# Altium schematic sheet Power.SchDoc
size A
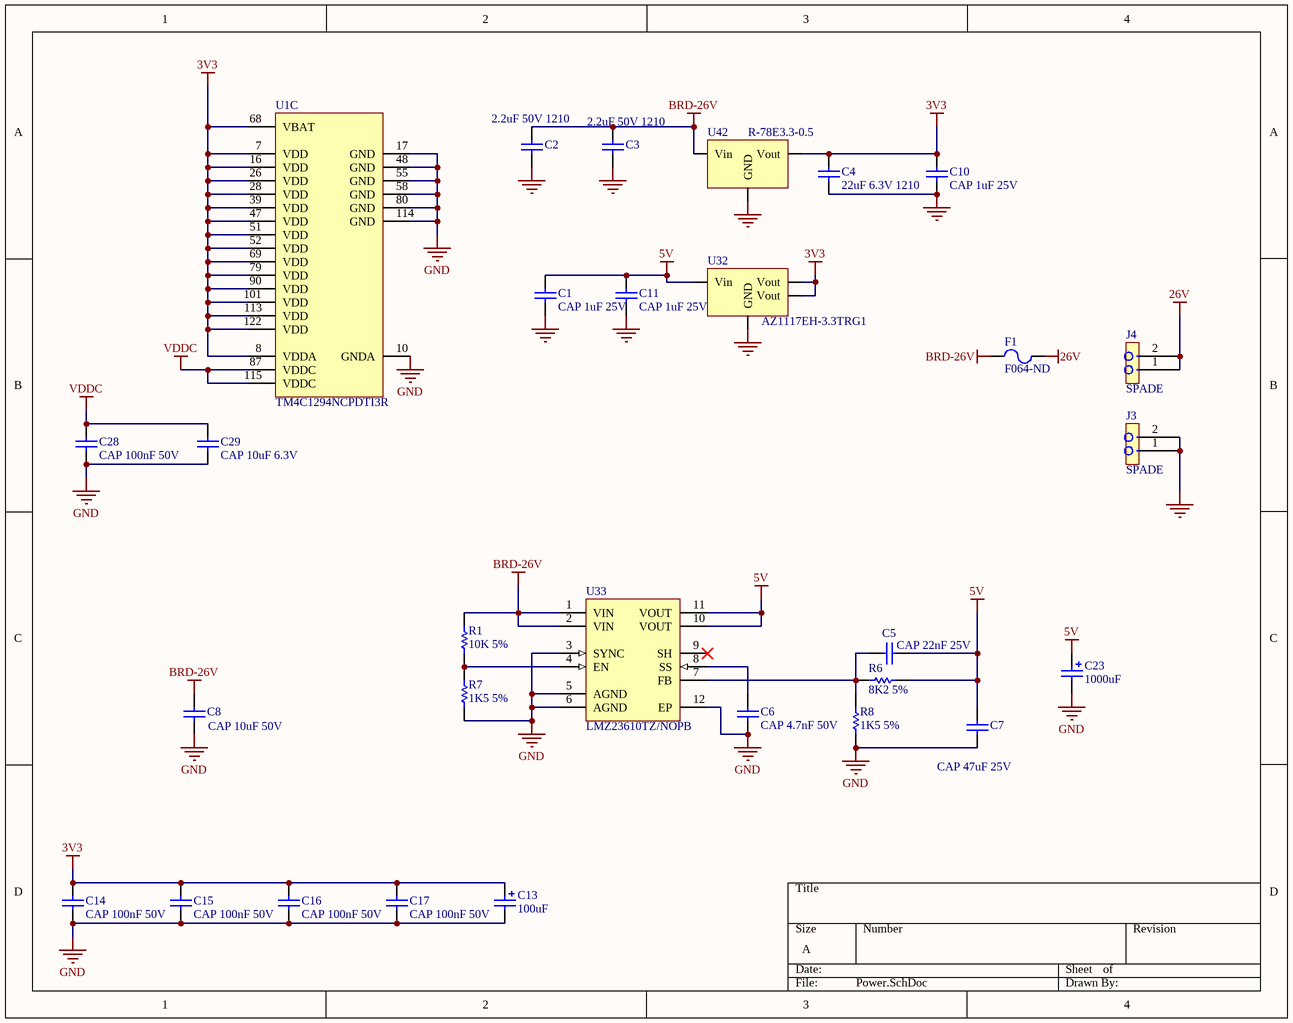
[diagram p0: Power.SchDoc]

## Parts
C1  CAP 1uF 25V  [CAPC0603(1608)100_M]
C2  2.2uF 50V 1210  [CAPC1210(3225)280_M]
C3  2.2uF 50V 1210  [CAPC1210(3225)280_M]
C4  22uF 6.3V 1210  [CAPC1210(3225)220_N]
C5  CAP 22nF 25V  [CAPC0805(2012)100_M]
C6  CAP 4.7nF 50V  [CAPC0603(1608)100_M]
C7  CAP 47uF 25V  [CAPC1206(3216)100_L]
C8  CAP 10uF 50V  [CAPC1206(3216)190_M]
C10  CAP 1uF 25V  [CAPC0603(1608)100_M]
C11  CAP 1uF 25V  [CAPC0603(1608)100_M]
C13  100uF  [PANASONIC_C]
C14  CAP 100nF 50V  [CAPC0603(1608)100_M]
C15  CAP 100nF 50V  [CAPC0603(1608)100_M]
C16  CAP 100nF 50V  [CAPC0603(1608)100_M]
C17  CAP 100nF 50V  [CAPC0603(1608)100_M]
C23  1000uF  [PANASONIC_H13]
C28  CAP 100nF 50V  [CAPC0603(1608)100_M]
C29  CAP 10uF 6.3V  [CAPC0603(1608)100_M]
F1  Supplier Part Number 1: F064-ND  [FUSE_HOLDER]  (hidden comment: FUSE-2)
J3  SPADE  [SPADE-6.35-RA]
J4  SPADE  [SPADE-6.35-RA]
R1  10K 5%  [RESC0603(1608)_M]
R6  8K2 5%  [RESC0603(1608)_L]
R7  1K5 5%  [RESC0603(1608)_M]
R8  1K5 5%  [RESC0603(1608)_M]
U1  TM4C1294NCPDTI3R  [TI-PDT128_M]  (part C of 3)
U32  AZ1117EH-3.3TRG1  [SOT-223]
U33  LMZ23610TZ/NOPB  [NDY0011A_M]
U42  R-78E3.3-0.5  [Buck_mod]

## Nets
3V3: C4.2 C10.2 C13.+ C14.2 C15.2 C16.2 C17.2 U1.7(VDD) U1.8(VDDA) U1.16(VDD) U1.26(VDD) U1.28(VDD) U1.39(VDD) U1.47(VDD) U1.51(VDD) U1.52(VDD) U1.68(VBAT) U1.69(VDD) U1.79(VDD) U1.90(VDD) U1.101(VDD) U1.113(VDD) U1.122(VDD) U32.2(Vout) U32.4(Vout) U42.3(Vout)
5V: C1.2 C5.2 C7.1 C11.2 C23.+ R6.1 U32.3(Vin) U33.10(VOUT) U33.11(VOUT)
26V: F1.1 J4.1 J4.2
BRD-26V: C2.2 C3.2 C8.1 F1.2 R1.2 U33.1(VIN) U33.2(VIN) U42.1(Vin)
GND: C1.1 C2.1 C3.1 C4.1 C6.1 C7.2 C8.2 C10.1 C11.1 C13.- C14.1 C15.1 C16.1 C17.1 C23.- C28.1 C29.1 J3.1 J3.2 R7.1 R8.1 U1.10(GNDA) U1.17(GND) U1.48(GND) U1.55(GND) U1.58(GND) U1.80(GND) U1.114(GND) U32.1(GND) U33.3(SYNC) U33.5(AGND) U33.6(AGND) U33.12(EP) U42.2(GND)
VDDC: C28.2 C29.2 U1.87(VDDC) U1.115(VDDC)
NetC5_1: C5.1 R6.2 R8.2 U33.7(FB)
NetC6_2: C6.2 U33.8(SS)
NetR1_1: R1.1 R7.2 U33.4(EN)

Not connected (* = marked no-connect by the designer): U33 9(SH)*

## Library data of the parts
C1 C10 C11 = CMP-1035-00037-1: CAP 1uF 25V Â±0.25pF 0603 (1608 Metric) Thickness 1mm SMD; Case-Metric: 1608; Case-EIA: 0603; Tolerance: Â±0.25pF; Max Thickness: 1 mm; Value: 1uF; Technology: SMT; Rated Voltage: 25 V
C2 C3 = CMP-1038-02102-1: CAP 2.2uF 50V ±20% 1210 (3225 Metric) Thickness 2.8mm SMD; Case-Metric: 3225; Case-EIA: 1210; Tolerance: Â±20%; Rated Voltage: 50 V; Technology: SMT; Value: 2.2uF; Max Thickness: 2.8 mm
C4 = CMP-1038-02259-1: CAP 22uF 6.3V ±10% 1210 (3225 Metric) Thickness 2.2mm SMD; Case-Metric: 3225; Case-EIA: 1210; Tolerance: Â±10%; Max Thickness: 2.2 mm; Rated Voltage: 6.3 V; Technology: SMT; Value: 22uF
C5 = CMP-1036-04051-1: CAP 22nF 25V Â±5% 0805 (2012 Metric) Thickness 1mm SMD; Case-Metric: 2012; Case-EIA: 0805; Technology: SMT; Max Thickness: 1 mm; Value: 22nF; Rated Voltage: 25 V; Tolerance: Â±5%
C6 = CMP-1035-00333-1: CAP 4.7nF 50V Â±20% 0603 (1608 Metric) Thickness 1mm SMD; Case-EIA: 0603; Case-Metric: 1608; Max Thickness: 1 mm; Rated Voltage: 50 V; Technology: SMT; Tolerance: Â±20%; Value: 4.7nF
C7 = CMP-1037-00376-1: CAP 47uF 25V Â±0.25pF 1206 (3216 Metric) Thickness 1mm SMD; Case-EIA: 1206; Case-Metric: 3216; Technology: SMT; Max Thickness: 1 mm; Value: 47uF; Tolerance: Â±0.25pF; Rated Voltage: 25 V
C8 = CMP-1037-04982-1: CAP 10uF 50V Â±10% 1206 (3216 Metric) Thickness 1.9mm SMD; Case-EIA: 1206; Case-Metric: 3216; Technology: SMT; Tolerance: Â±10%; Max Thickness: 1.9 mm; Value: 10uF; Rated Voltage: 50 V
C13 = Cap_Polarized_100uF: Polarized Capacitor (Surface Mount); Published: 8-Jun-2000; LatestRevisionDate: 29-May-2009; LatestRevisionNote: IPC-7351 Footprint Added.; PackageReference: C0805; Publisher: Altium Limited; PackageDescription: Chip Capacitor; Value: 100uF; Supplier 1: Digi-Key; Supplier 2: Mouser; Supplier Part Number 1: PCE4718CT-ND; Supplier Part Number 2: 667-EEE-HAJ101WAR
C14-C17 C28 = CMP-1035-00010-1: CAP 100nF 50V Â±0.1pF 0603 (1608 Metric) Thickness 1mm SMD; Case-Metric: 1608; Case-EIA: 0603; Tolerance: Â±0.1pF; Technology: SMT; Value: 100nF; Max Thickness: 1 mm; Rated Voltage: 50 V
C23 = Cap_Polarized_1000uF: Polarized Capacitor (Surface Mount); Published: 8-Jun-2000; LatestRevisionDate: 29-May-2009; LatestRevisionNote: IPC-7351 Footprint Added.; PackageReference: C0805; Publisher: Altium Limited; PackageDescription: Chip Capacitor; Value: 1000uF; Supplier 1: Digi-Key; Supplier 2: Mouser; Supplier Part Number 1: PCE3462CT-ND; Supplier Part Number 2: 140-VE102M1ETR1313
C29 = CMP-1035-02796-1: CAP 10uF 6.3V ±10% 0603 (1608 Metric) Thickness 1mm SMD; Case-EIA: 0603; Tolerance: Â±10%; Case-Metric: 1608; Value: 10uF; Technology: SMT; Rated Voltage: 6.3 V; Max Thickness: 1 mm
J3 J4 = CON2: 6.35mm right-angle 90° male spade terminal PCB mount; CID: 643; CID2: 643; CID3: 643
R1 = CMP-1012-00098-1: 10K 0.1W 5% 0603 (1608 Metric)  SMD; Case-EIA: 0603; Value: 10000.00 Ohm; Case-Metric: 1608; Technology: SMT; Tolerance: 5 %; Power: 0.1 W
R6 = CMP-1012-00096-1: 8K2 0.1W 5% 0603 (1608 Metric)  SMD; Value: 8200.00 Ohm; Case-EIA: 0603; Case-Metric: 1608; Tolerance: 5 %; Technology: SMT; Power: 0.1 W
R7 R8 = CMP-1012-00078-1: 1K5 0.1W 5% 0603 (1608 Metric)  SMD; Case-Metric: 1608; Case-EIA: 0603; Value: 1500.00 Ohm; Technology: SMT; Power: 0.1 W; Tolerance: 5 %
U1 = CMP-0945-00007-1: Tiva C Series Microcontroller, 1024 KB Flash, 256 KB SRAM, 12 Bit, 20 Channels, -40 to 85 degC, 128-Pin TQFP (PDT), Green (RoHS & no Sb/Br), Tape and Reel; Manufacturer: Texas Instruments; SRAM: 256 KB; ADC Resolution: 12 Bits; ADC Channels: 20; Flash: 1024 KB; Max Speed: 120 MHz; CPU: ARM Cortex-M4; Packing: Tape and Reel; Mounting Technology: Surface Mount; Eco-Plan: Green (RoHS & no Sb/Br); ComponentLink1URL: http://www.ti.com/; ComponentLink3Description: Package Specification; ComponentLink2Description: Datasheet; PartNumber: TM4C1294NCPDTI3R; DatasheetVersion: 15863.2743; ComponentLink1Description: Manufacturer URL; ComponentLink3URL: http://www.ti.com/lit/ml/mpqf013/mpqf013.pdf; Temperature Range: -40 to 85 degC; ComponentLink2URL: http://www.ti.com/lit/ds/symlink/tm4c1294ncpdt.pdf; PackageVersion: 4087726/A; PackageDescription: 128-Pin Thin Quad Flat Package, Body 14 x 14 mm, Pitch 0.4 mm; PartId: 2
U32 = AZ1117EH: Reg 1A 3V3 OUT SIP VERT; Supplier 1: Digi-Key; Supplier Part Number 1: AZ1117EH-3.3TRG1DICT-ND
U33 = CMP-0069-02067-2: 10A SIMPLE SWITCHER® Power Module with 36V Maximum Input Voltage and Current Sharing, 11 pin TO-PMOD, 32 Rail; Manufacturer: Texas Instruments; PackageTopMarking: NSUZXYTTE#*LMZ23610; PowerWise: N; RoHS: Y; ComponentLink1Description: Datasheet URL; PinCount: 11; PackageDescription: TO-PMOD, 15 x 15 x 5.9 mm Body, 11 Lead, 1.27 mm Pitch, Surface Mount; ComponentLink1URL: http://www.ti.com/general/docs/lit/getliterature.tsp?genericPartNumber=LMZ23610&fileType=pdf; PackageReference: NDY0011A; CompType: Switcher
U42 = Buck 3V3 OUT SIP VERT: 3V3 OUT SIP VERT; Supplier 1: Digikey; Supplier Part Number 1: 945-1661-5-ND
F1 = FUSE-2: Supplier 1: Digi-Key